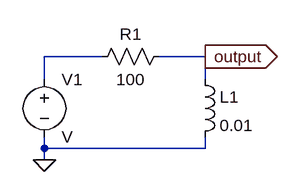
[diagram p0: schematic rl_highpass.asc]
rl_highpass.asc, the LTspice schematic file:
Version 4
SHEET 1 880 680
WIRE 176 128 96 128
WIRE 320 128 256 128
WIRE 96 160 96 128
WIRE 320 160 320 128
WIRE 96 256 96 240
WIRE 320 256 320 240
WIRE 320 256 96 256
WIRE 96 272 96 256
FLAG 96 272 0
FLAG 320 128 output
IOPIN 320 128 Out
SYMBOL ind 304 144 R0
SYMATTR InstName L1
SYMATTR Value 0.01
SYMBOL res 160 144 R270
WINDOW 0 32 56 VTop 2
WINDOW 3 0 56 VBottom 2
SYMATTR InstName R1
SYMATTR Value 100
SYMBOL voltage 96 144 R0
SYMATTR InstName V1

The netlist it stands for:
* rl_highpass.asc
L1 output 0 0.01
R1 N001 output 100
V1 N001 0 V
.backanno
.end